# EAGLE design External Stepper Adapter v1 (EAGLE 6.4)
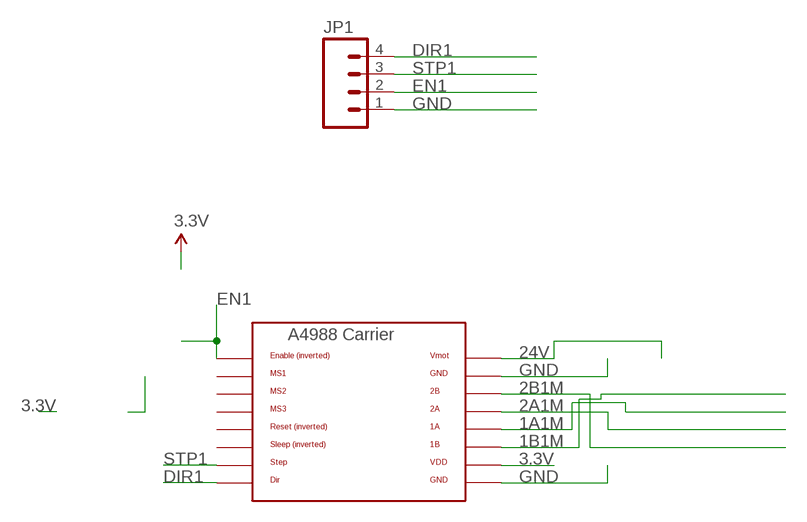
[diagram p0: schematic, sheet 1]

## Parts
JP1  M04PTH  [1X04]
U$1  POLOLU_A4983CARRIER  [A4988BREAKOUT]

## Nets
1A1M: U$1.1A
1B1M: U$1.1B
2A1M: U$1.2A
2B1M: U$1.2B
3.3V: U$1.VDD
24V: U$1.VMOT
DIR1: JP1.4 U$1.DIR
EN1: JP1.2 U$1.EN
GND: JP1.1 U$1.GND U$1.GND@0(GND)
STP1: JP1.3 U$1.STEP
Unconnected: U$1.MS1 U$1.MS2 U$1.MS3 U$1.RST U$1.SLP(SLEEP)

## Library data of the parts
JP1 = SparkFun-Connectors:M04: Header 4 Standard 4-pin 0.1" header. Use with straight break away headers (SKU : PRT-00116), right angle break away headers (PRT-00553), swiss pins (PRT-00743), machine pins (PRT-00117), and female headers (PRT-00115). Molex polarized connector foot print use with SKU : PRT-08231 with associated crimp pins and housings. 1MM SMD Version SKU: PRT-10208
U$1 = RepRapjr:POLOLU_A4983CARRIER

## Board
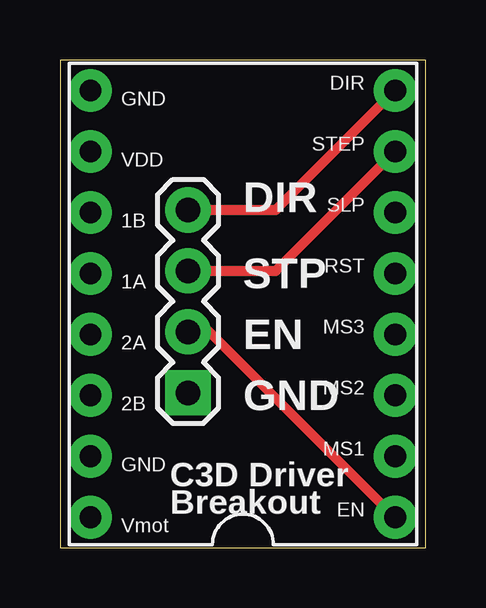
[diagram p1: board, top side]
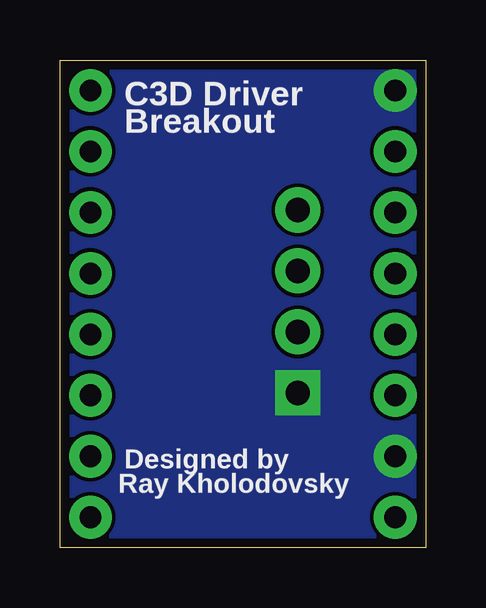
[diagram p2: board, bottom side, seen from below]

Size 15.24 x 20.32 mm. Coordinates in mm from the lower left corner, seen from the top.
Outline: 0,0 15.24,0 15.24,20.32 0,20.32 0,0
Copper layers (1*16): Top 0.0356mm / dielectric 1.5011mm / Bottom 0.0356mm
Design rules "LaenPCBOrder": minimum track width 6mil, minimum drill 13mil, track to track 6mil, track to pad 6mil, pad to pad 6mil, via to via 6mil, smd to smd 6mil, copper to edge 15mil, drill to drill 6mil, minimum pad ring 7mil, minimum via ring 7mil, stop-mask expansion 3mil, vias tented up to drill 0mil, thermal gap 10mil

### Footprints (pad centres in the part's own frame; a part is rotated, then mirrored left to right if it is on the bottom)
1X04 = drill 1.016 pad 1.88 square: 1 0,0 | drill 1.016 pad 1.88: 2 2.54,0; 3 5.08,0; 4 7.62,0
A4988BREAKOUT = drill 0.9 pad 1.778: 1A 8.89,1.27; 1B 11.43,1.27; 2A 6.35,1.27; 2B 3.81,1.27; DIR 16.51,-11.43; EN -1.27,-11.43; GND 16.51,1.27; GND@0 1.27,1.27; MS1 1.27,-11.43; MS2 3.81,-11.43; MS3 6.35,-11.43; RST 8.89,-11.43; SLP 11.43,-11.43; STEP 13.97,-11.43; VDD 13.97,1.27; VMOT -1.27,1.27

### Placement (x,y rotation side)
JP1  5.33,6.45 90 top
U$1  2.54,2.54 90 top

### Tracks (layer width: path | path; a pad name or v marks a point on that pad's centre or on a via)
DIR1
  Top 0.406: JP1.4 8.99,14.07 U$1.DIR
EN1
  Top 0.406: U$1.EN 13.95,1.27 6.22,8.99 JP1.2
GND
  pour Bottom (no thermals): -0.38,-0.53 15.49,-0.53 15.49,21.06 -0.38,21.06
STP1
  Top 0.406: JP1.3 8.99,11.53 U$1.STEP

### Text on the board
tPlace: DIR | STP | EN | GND | C3D Driver | Breakout
bPlace: C3D Driver | Breakout | Designed by | Ray Kholodovsky